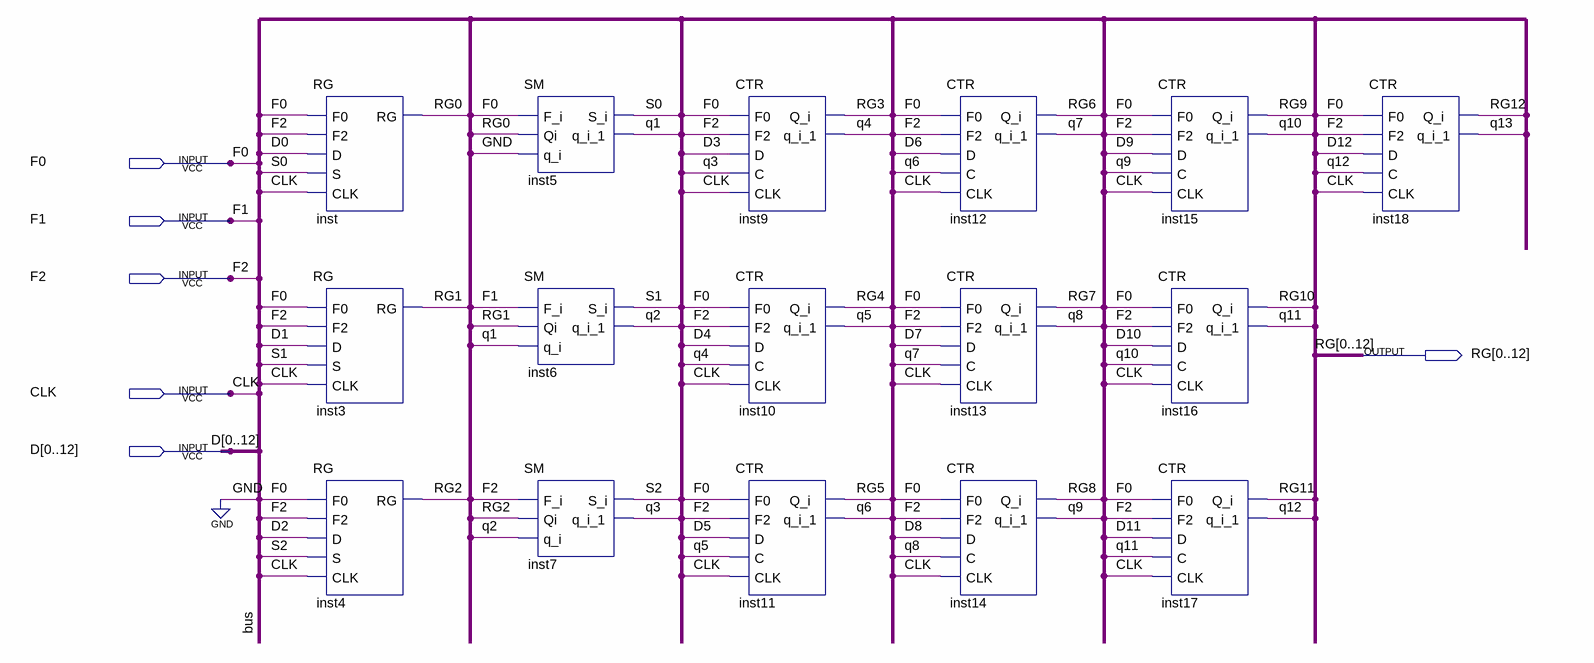
[diagram p0: schematic sheet]
// Quartus schematic Lab1.bdf as structural Verilog: 16 symbols, 6 pins
module Lab1 (
  input  F0,
  input  F1,
  input  F2,
  input  CLK,
  input  [0:12] D,
  output [0:12] RG
);

  wire q1, q2, q3, q4, q5, q6, q7, q8, q9, q10, q11, q12, q13, S0, S1, S2;

  RG inst (.F0(F0), .F2(F2), .D(D[0]), .S(S0), .CLK(CLK), .RG(RG[0]));
  RG inst3 (.F0(F0), .F2(F2), .D(D[1]), .S(S1), .CLK(CLK), .RG(RG[1]));
  RG inst4 (.F0(F0), .F2(F2), .D(D[2]), .S(S2), .CLK(CLK), .RG(RG[2]));
  SM inst5 (.F_i(F0), .Qi(RG[0]), .q_i(1'b0), .S_i(S0), .q_i_1(q1));
  SM inst6 (.F_i(F1), .Qi(RG[1]), .q_i(q1), .S_i(S1), .q_i_1(q2));
  SM inst7 (.F_i(F2), .Qi(RG[2]), .q_i(q2), .S_i(S2), .q_i_1(q3));
  CTR inst9 (.F0(F0), .F2(F2), .D(D[3]), .C(q3), .CLK(CLK), .q_i_1(q4), .Q_i(RG[3]));
  CTR inst10 (.F0(F0), .F2(F2), .D(D[4]), .C(q4), .CLK(CLK), .q_i_1(q5), .Q_i(RG[4]));
  CTR inst11 (.F0(F0), .F2(F2), .D(D[5]), .C(q5), .CLK(CLK), .q_i_1(q6), .Q_i(RG[5]));
  CTR inst12 (.F0(F0), .F2(F2), .D(D[6]), .C(q6), .CLK(CLK), .q_i_1(q7), .Q_i(RG[6]));
  CTR inst13 (.F0(F0), .F2(F2), .D(D[7]), .C(q7), .CLK(CLK), .q_i_1(q8), .Q_i(RG[7]));
  CTR inst14 (.F0(F0), .F2(F2), .D(D[8]), .C(q8), .CLK(CLK), .q_i_1(q9), .Q_i(RG[8]));
  CTR inst15 (.F0(F0), .F2(F2), .D(D[9]), .C(q9), .CLK(CLK), .q_i_1(q10), .Q_i(RG[9]));
  CTR inst16 (.F0(F0), .F2(F2), .D(D[10]), .C(q10), .CLK(CLK), .q_i_1(q11), .Q_i(RG[10]));
  CTR inst17 (.F0(F0), .F2(F2), .D(D[11]), .C(q11), .CLK(CLK), .q_i_1(q12), .Q_i(RG[11]));
  CTR inst18 (.F0(F0), .F2(F2), .D(D[12]), .C(q12), .CLK(CLK), .q_i_1(q13), .Q_i(RG[12]));
endmodule
